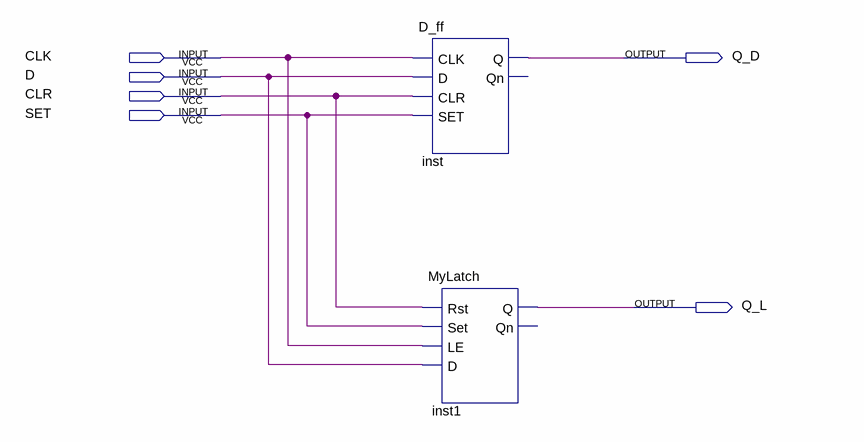
[diagram p0: schematic sheet]
// Quartus schematic part2.bdf as structural Verilog: 2 symbols, 6 pins
module part2 (
  input  CLK,
  input  D,
  input  CLR,
  input  SET,
  output Q_D,
  output Q_L
);

  D_ff inst (.CLK(CLK), .D(D), .CLR(CLR), .SET(SET), .Q(Q_D));  // open: Qn
  MyLatch inst1 (.Rst(CLR), .Set(SET), .LE(CLK), .D(D), .Q(Q_L));  // open: Qn
endmodule
